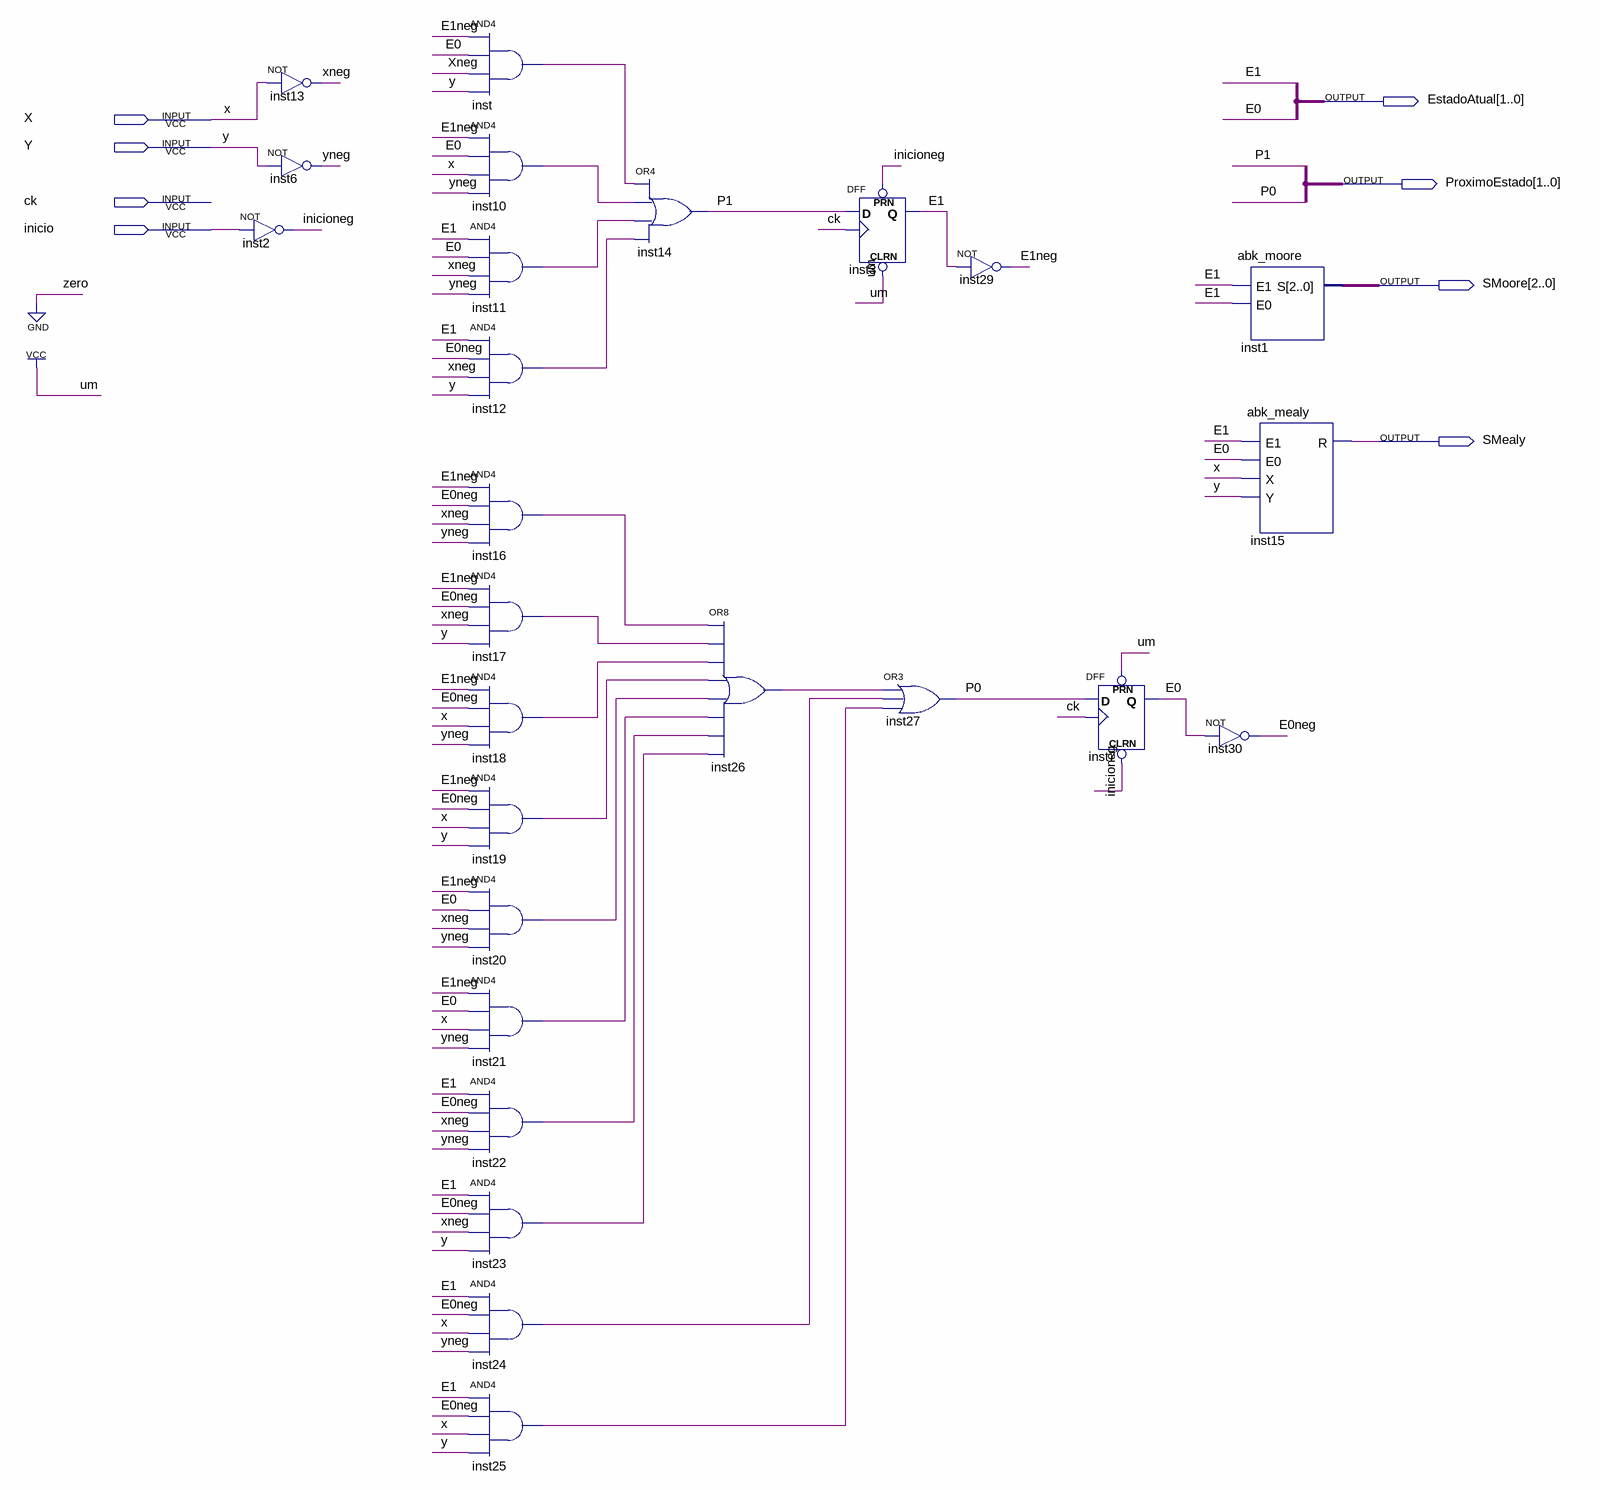
[diagram p0: schematic sheet]
// Quartus schematic abk_maquina.bdf as structural Verilog: 26 symbols, 8 pins
module abk_maquina (
  input  X,
  input  Y,
  input  ck,
  input  inicio,
  output [1:0] EstadoAtual,
  output [1:0] ProximoEstado,
  output [2:0] SMoore,
  output SMealy
);

  wire E0, E0neg, E1, E1neg, inicioneg, inst10_out, inst11_out, inst12_out, inst16_out, inst17_out,
       inst18_out, inst19_out, inst20_out, inst21_out, inst22_out, inst23_out, inst24_out, inst25_out,
       inst26_out, inst_out, P0, P1, Xneg, yneg;

  not inst2 (inicioneg, inicio);
  not inst13 (Xneg, X);
  not inst6 (yneg, Y);
  and inst (inst_out, E1neg, E0, Xneg, Y);
  and inst10 (inst10_out, E1neg, E0, X, yneg);
  and inst11 (inst11_out, E1, E0, Xneg, yneg);
  and inst12 (inst12_out, E1, E0neg, Xneg, Y);
  and inst16 (inst16_out, E1neg, E0neg, Xneg, yneg);
  and inst17 (inst17_out, E1neg, E0neg, Xneg, Y);
  and inst18 (inst18_out, E1neg, E0neg, X, yneg);
  and inst19 (inst19_out, E1neg, E0neg, X, Y);
  and inst20 (inst20_out, E1neg, E0, Xneg, yneg);
  and inst21 (inst21_out, E1neg, E0, X, yneg);
  and inst22 (inst22_out, E1, E0neg, Xneg, yneg);
  and inst23 (inst23_out, E1, E0neg, Xneg, Y);
  and inst24 (inst24_out, E1, E0neg, X, yneg);
  and inst25 (inst25_out, E1, E0neg, X, Y);
  or inst14 (P1, inst_out, inst10_out, inst11_out, inst12_out);
  or inst26 (inst26_out, inst16_out, inst17_out, inst18_out, inst19_out, inst20_out, inst21_out, inst22_out, inst23_out);
  DFF inst3 (.CLRN(1'b1), .CLK(ck), .D(P1), .PRN(inicioneg), .Q(E1));
  or inst27 (P0, inst26_out, inst24_out, inst25_out);
  not inst29 (E1neg, E1);
  DFF inst7 (.CLRN(inicioneg), .CLK(ck), .D(P0), .PRN(1'b1), .Q(E0));
  abk_moore inst1 (.E1(E1), .E0(E1), .S(SMoore));
  abk_mealy inst15 (.E1(E1), .E0(E0), .X(X), .Y(Y), .R(SMealy));
  not inst30 (E0neg, E0);
endmodule
